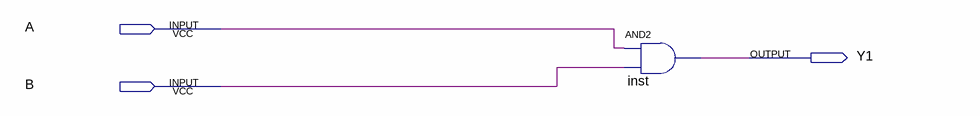
[diagram p0: schematic sheet]
// Quartus schematic and_timing.bdf as structural Verilog: 1 symbols, 3 pins
module and_timing (
  input  A,
  input  B,
  output Y1
);

  and inst (Y1, A, B);
endmodule
